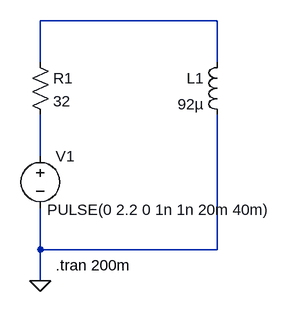
[diagram p0: schematic lab3_rl.asc]
lab3_rl.asc, the LTspice schematic file:
Version 4
SHEET 1 880 680
WIRE 320 -32 48 -32
WIRE 48 32 48 -32
WIRE 320 32 320 -32
WIRE 48 176 48 112
WIRE 48 320 48 256
WIRE 320 320 320 112
WIRE 320 320 48 320
WIRE 48 368 48 320
FLAG 48 368 0
SYMBOL voltage 48 160 R0
WINDOW 123 0 0 Left 0
WINDOW 39 0 0 Left 0
WINDOW 3 11 99 Left 2
SYMATTR Value PULSE(0 2.2 0 1n 1n 20m 40m)
SYMATTR InstName V1
SYMBOL res 32 16 R0
SYMATTR InstName R1
SYMATTR Value 32
SYMBOL ind 336 16 M0
SYMATTR InstName L1
SYMATTR Value 92µ
TEXT 72 344 Left 2 !.tran 200m

The netlist it stands for:
* lab3_rl.asc
V1 N002 0 PULSE(0 2.2 0 1n 1n 20m 40m)
R1 N001 N002 32
L1 N001 0 92µ
.tran 200m
.backanno
.end